# Altium schematic sheet Interfaz digital.SchDoc
size A4; DocumentNumber: 6; SheetNumber: 6; SheetTotal: 7
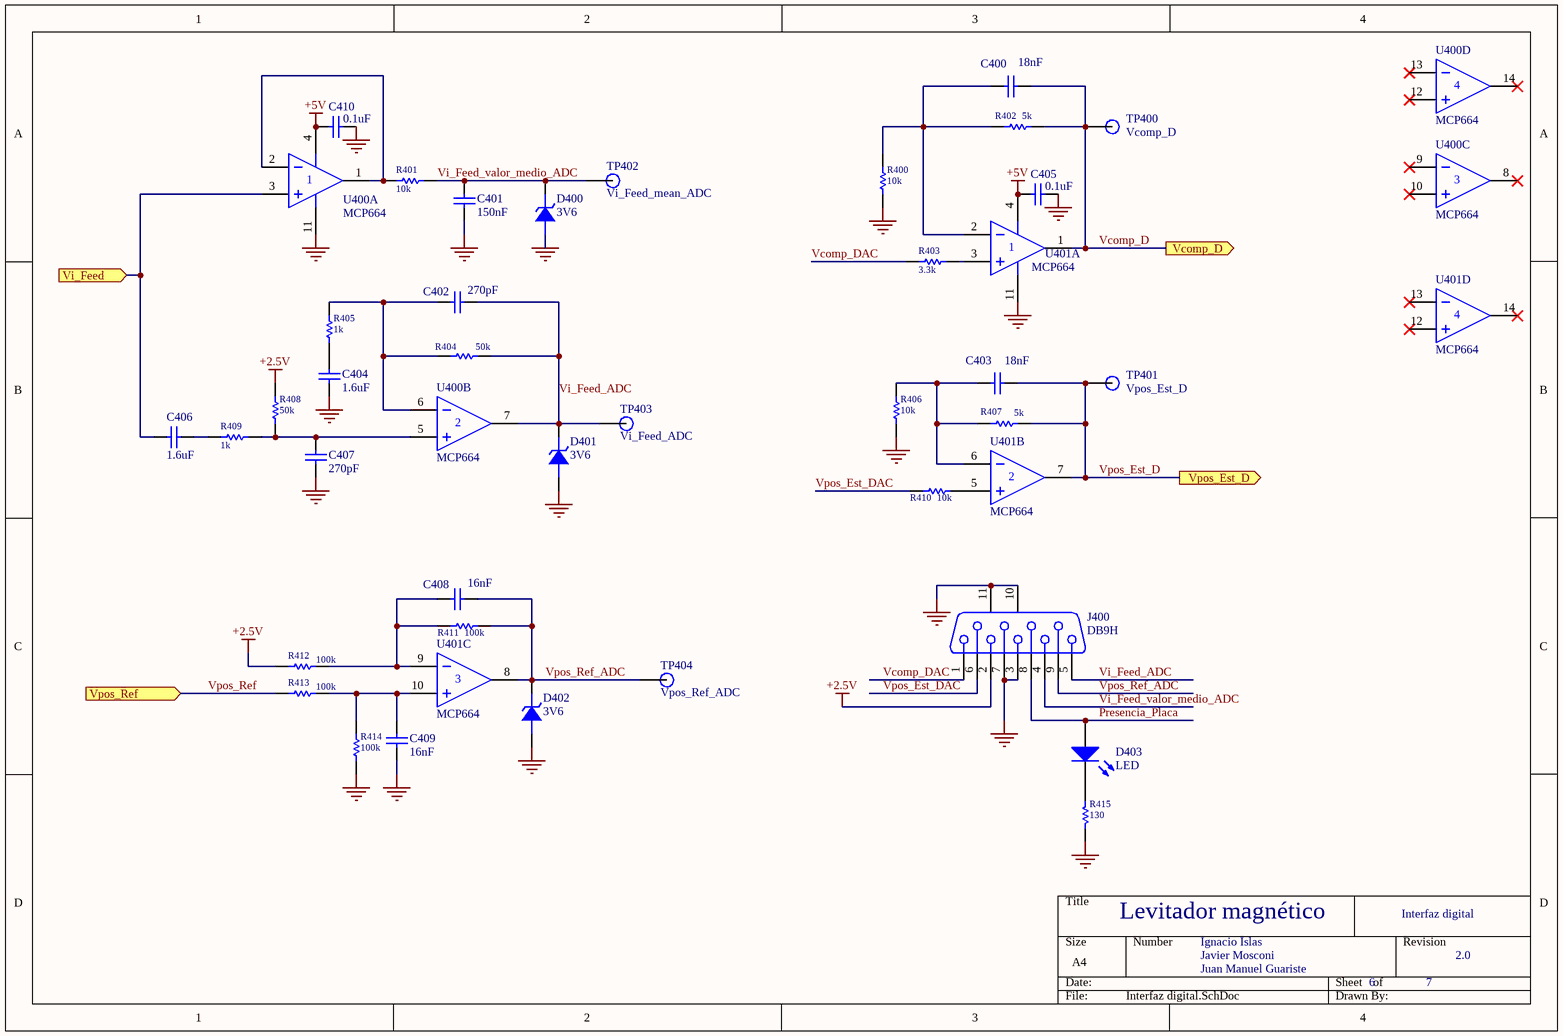
[diagram p0: Interfaz digital.SchDoc]

## Parts
C400  value 18nF  [C1206]  (hidden comment: Capacitor)
C401  value 150nF  [C1206]  (hidden comment: Capacitor)
C402  value 270pF  [C1206]  (hidden comment: Capacitor)
C403  value 18nF  [C1206]  (hidden comment: Capacitor)
C404  value 1.6uF  [C1206]  (hidden comment: Capacitor)
C405  value 0.1uF  [C1206]  (hidden comment: Capacitor)
C406  value 1.6uF  [C1206]  (hidden comment: Capacitor)
C407  value 270pF  [C1206]  (hidden comment: Capacitor)
C408  value 16nF  [C1206]  (hidden comment: Capacitor)
C409  value 16nF  [C1206]  (hidden comment: Capacitor)
C410  value 0.1uF  [C1206]  (hidden comment: Capacitor)
D400  value 3V6  [SMB]  (hidden comment: Diodo Zener)
D401  value 3V6  [SMB]  (hidden comment: Diodo Zener)
D402  value 3V6  [SMB]  (hidden comment: Diodo Zener)
D403  LED  [LED 1206 RED]
J400  DB9H  [DB9H]
R400  10k  [R1206]
R401  10k  [R1206]
R402  5k  [R1206]
R403  3.3k  [R1206]
R404  50k  [R1206]
R405  1k  [R1206]
R406  10k  [R1206]
R407  5k  [R1206]
R408  50k  [R1206]
R409  1k  [R1206]
R410  10k  [R1206]
R411  100k  [R1206]
R412  100k  [R1206]
R413  100k  [R1206]
R414  100k  [R1206]
R415  130  [R1206]
TP400  Vcomp_D  [TestPoint Keystone 5000 Silver-Red]
TP401  Vpos_Est_D  [TestPoint Keystone 5000 Silver-Red]
TP402  Vi_Feed_mean_ADC  [TestPoint Keystone 5000 Silver-Red]
TP403  Vi_Feed_ADC  [TestPoint Keystone 5000 Silver-Red]
TP404  Vpos_Ref_ADC  [TestPoint Keystone 5000 Silver-Red]
U400  MCP664  [SOIC14]  (parts A,B,C,D of 4)
U401  MCP664  [SOIC14]  (parts A,B,C,D of 4)

## Ports
Vcomp_D (out), Vi_Feed (in), Vpos_Est_D (out), Vpos_Ref (in)

## Nets
+2.5V: J400.2 R408.2 R412.1
+5V: C405.1 C410.1 U400.4(V+) U401.4(V+)
GND: C401.1 C404.2 C405.2 C407.1 C409.2 C410.2 D400.1 D401.1 D402.1 J400.3 J400.7 J400.10(MH1) J400.11(MH2) R400.1 R406.1 R414.1 R415.1 U400.11(V-) U401.11(V-)
Presencia_Placa: D403.1(A) J400.8
Vcomp_D: C400.1 R402.2 TP400.1 U401.1(OUT) ; port Vcomp_D
Vcomp_DAC: J400.1 R403.1
Vi_Feed: C406.1 U400.3(IN+) ; port Vi_Feed
Vi_Feed_ADC: C402.1 D401.2 J400.5 R404.2 TP403.1 U400.7(OUT)
Vi_Feed_valor_medio_ADC: C401.2 D400.2 J400.4 R401.2 TP402.1
Vpos_Est_D: C403.1 R407.2 TP401.1 U401.7(OUT) ; port Vpos_Est_D
Vpos_Est_DAC: J400.6 R410.1
Vpos_Ref: R413.1 ; port Vpos_Ref
Vpos_Ref_ADC: C408.1 D402.2 J400.9 R411.2 TP404.1 U401.8(OUT)
NetC400_2: C400.2 R400.2 R402.1 U401.2(IN-)
NetC402_2: C402.2 R404.1 R405.2 U400.6(IN-)
NetC403_2: C403.2 R406.2 R407.1 U401.6(IN-)
NetC404_1: C404.1 R405.1
NetC406_2: C406.2 R409.1
NetC407_2: C407.2 R408.1 R409.2 U400.5(IN+)
NetC408_2: C408.2 R411.1 R412.2 U401.9(IN-)
NetC409_1: C409.1 R413.2 R414.2 U401.10(IN+)
NetD403_2: D403.2(K) R415.2
NetR401_1: R401.1 U400.1(OUT) U400.2(IN-)
NetR403_2: R403.2 U401.3(IN+)
NetR410_2: R410.2 U401.5(IN+)

Not connected (* = marked no-connect by the designer): U400 8(OUT)* 9(IN-)* 10(IN+)* 12(IN+)* 13(IN-)* 14(OUT)*; U401 12(IN+)* 13(IN-)* 14(OUT)*

## Notes on the sheet
- Levitador magnético
- Interfaz digital
- Ignacio Islas
- Javier Mosconi
- Juan Manuel Guariste
- 2.0

## Library data of the parts
C400 C403 = Capacitor: CAP CER 0.018UF 100V X7R 1206; Mfr PN: C1206C183K1RAC7800; Manufacturer: KEMET; Supplier 1: Digi-Key; Supplier 1 PN: 399-C1206C183K1RAC7800CT-ND
C401 = Capacitor: CAP CER 0.15UF 50V X7R 1206; Mfr PN: 12065C154KAT2A; Manufacturer: KYOCERA AVX; Supplier 1: Digi-Key; Supplier 1 PN: 478-1558-1-ND
C402 C407 = Capacitor: CAP CER 270PF 50V C0G/NP0 1206; Mfr PN: C1206C271J5GAC7800; Manufacturer: KEMET; Supplier 1: Digi-Key; Supplier 1 PN: 399-14675-1-ND
C404 C406 = Capacitor: CAP CER 1.5UF 10V X7R 1206; Manufacturer: YAGEO; Mfr PN: CC1206KKX7R6BB155; Supplier 1: Digi-Key; Supplier 1 PN: 311-3452-1-ND
C405 C410 = Capacitor: CAP CER 0.1UF 50V X7R 1206; Mfr PN: C1206X7R500-104KNE; Manufacturer: Venkel; Supplier 1: Digi-Key; Supplier 1 PN: 2679-C1206X7R500-104KNETR-ND
C408 C409 = Capacitor: CAP CER 0.016UF 50V C0G/NP0 1206; Mfr PN: GRM3195C1H163JA01D; Manufacturer: Murata Electronics; Supplier 1: Digi-Key; Supplier 1 PN: 490-12760-1-ND
D400-D402 = Diodo Zener: DIODE ZENER 3.6V 3W SMB; Manufacturer: onsemi; Mfr PN: 1SMB5914BT3G; Supplier 1 PN: 1SMB5914BT3GOSCT-ND; Supplier 1: Digi-Key
D403 = LED: 1206 RED SMD LED; Manufacturer: American Opto Plus LED; Mfr PN: L152L-LIC; Sipplier 1 PN: Digi-Key; Supplier 1: 2460-L152L-LICTR-ND
J400 = DB9H: CONN D-SUB RCPT 9POS R/A SLDR; Manufacturer: Assmann WSW Components; Mfr PN: A-DF 09 A/KG-T4S; Supplier 1 PN: AE10924-ND; Supplier 1: Digi-Key
R400 R401 R406 R410 = R1206: RES 10K OHM 1% 1/4W 1206; Mfr PN: RC1206FR-0710KL; Manufacturer: YAGEO; PackageReference: 1206; Supplier 1 PN: 311-10.0KFRCT-ND; Supplier 1: Digi-Key; Value: 10k; Tolerance: 1%
R402 R407 = R1206: RES SMD 5K OHM 1% 0.3W 1206; Mfr PN: Y16255K00000F9W; Manufacturer: Vishay Foil Resistors (Division of Vishay Precision Group); PackageReference: 1206; Supplier 1 PN: Y16255K00000F9W-ND; Supplier 1: Digi-Key; Value: 5k; Tolerance: 1%
R403 = R1206: RES SMD 3.3K OHM 1% 3/4W 1206; Mfr PN: CRCW12063K30FKEAHP; Manufacturer: Vishay Dale; PackageReference: 1206; Supplier 1 PN: 541-3.30KUCT-ND; Supplier 1: Digi-Key; Value: 3.3k; Tolerance: 1%
R404 R408 = R1206: RES SMD 50K OHM 0.1% 1/4W 1206; Mfr PN: RT1206BRD0750KL; Manufacturer: YAGEO; Supplier 1 PN: 13-RT1206BRD0750KLCT-ND; PackageReference: 1206; Supplier 1: Digi-Key; Value: 50k; Tolerance: 0.1%
R405 R409 = R1206: RES 1K OHM 1% 1/4W 1206; Mfr PN: RMCF1206FT1K00; Manufacturer: Stackpole Electronics Inc; PackageReference: 1206; Supplier 1 PN: RMCF1206FT1K00CT-ND; Supplier 1: Digi-Key; Value: 1k; Tolerance: 1%
R411-R414 = R1206: RES 100K OHM 1% 1/4W 1206; Mfr PN: RMCF1206FT100K; Manufacturer: Stackpole Electronics Inc; PackageReference: 1206; Supplier 1 PN: RMCF1206FT100KCT-ND; Supplier 1: Digi-Key; Value: 100k; Tolerance: 1%
R415 = R1206: RES 130 OHM 1% 1/4W 1206; Mfr PN: RMCF1206FT130R; Manufacturer: Stackpole Electronics Inc; Supplier 1: Digi-Key; Value: 130; Tolerance: 1%; Supplier 1 PN: RMCF1206FT130RCT-ND
TP400-TP404 = Testpoint: PC TEST POINT MINIATURE RED; Manufacturer: Keystone Electronics; Mfr PN: 5000; Link: https://www.digikey.com/en/products/detail/keystone-electronics/5000/255326; Supplier 1: Digi-Key; Supplier 1 PN: 36-5000-ND
U400 U401 = MCP664: IC OPAMP GP 4 CIRCUIT 14TSSOP; Mfr PN: MCP664-E/ST; Manufacturer: Microchip Technology; Datasheet: https://ar.mouser.com/datasheet/2/268/20002194E-2448650.pdf; Supplier 1: Digi-Key; Supplier 1 PN: MCP664-E/ST-ND